# Altium schematic sheet Sheet2.SchDoc
size A4; SheetNumber: 1; SheetTotal: 4
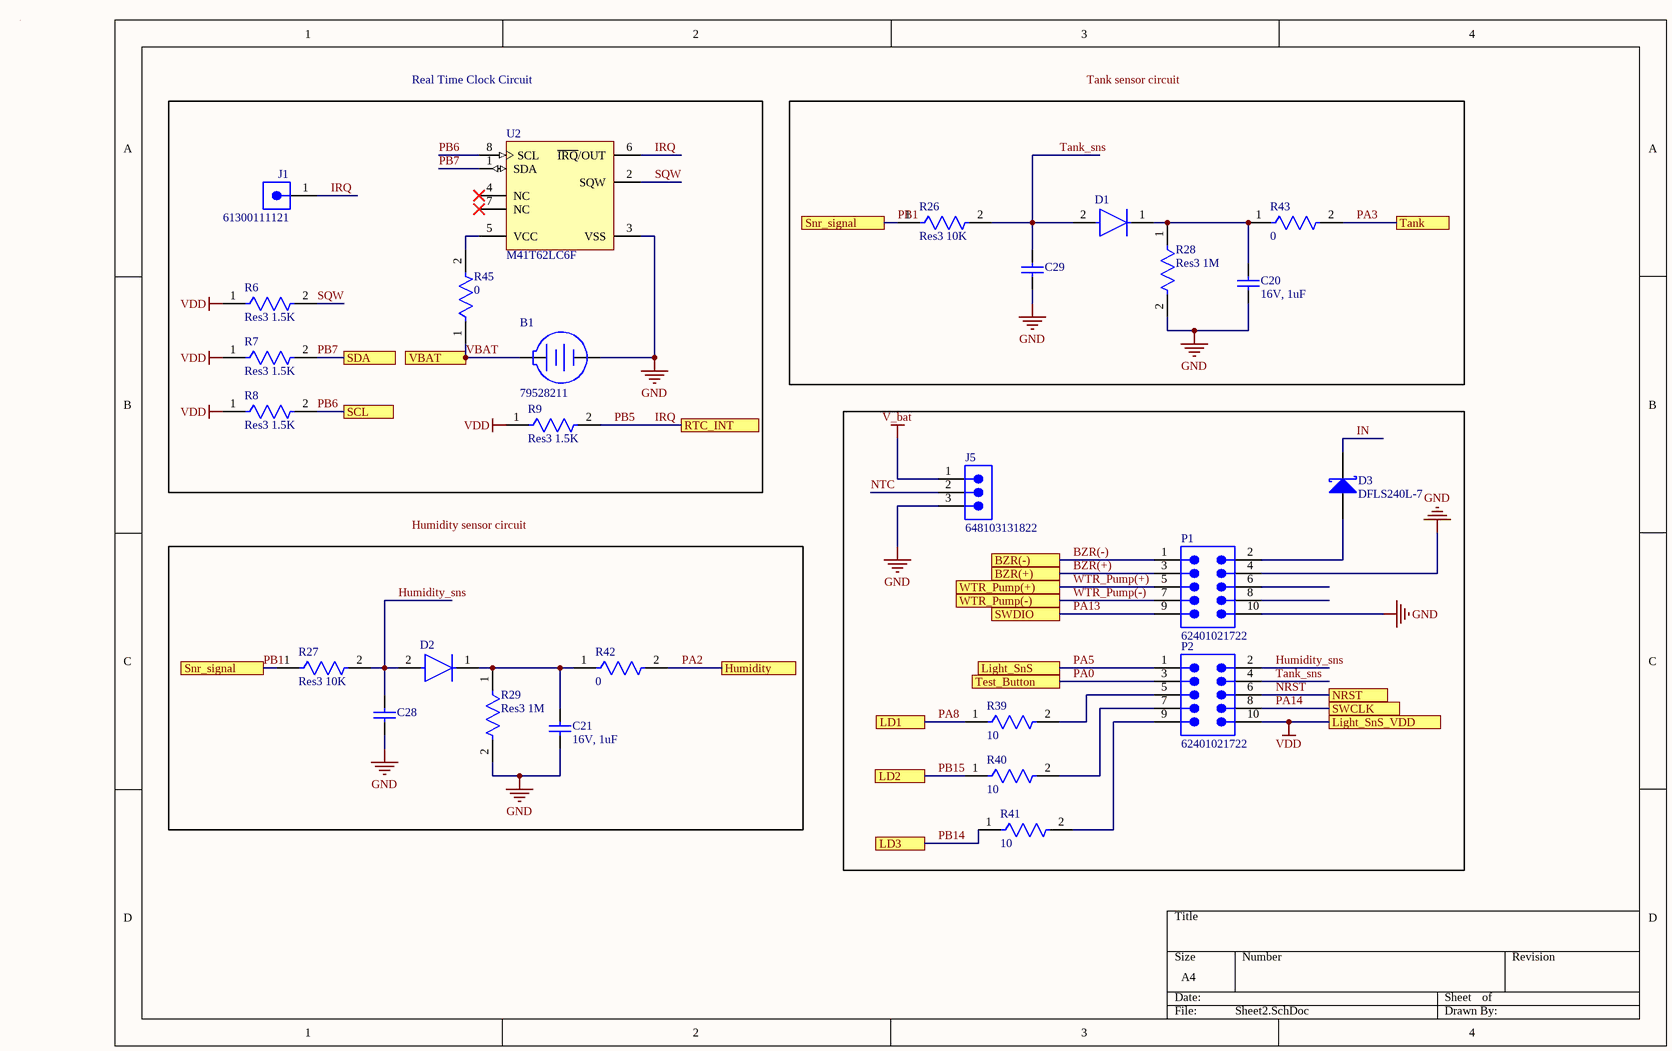
[diagram p0: Sheet2.SchDoc]

## Parts
B1  79528211  [79528211]
C20  16V, 1uF  [CAPC1608X90X35NL15T15]
C21  16V, 1uF  [CAPC1608X90X35NL15T15]
C28  16V, 1uF  [CAPC1608X90X35NL15T15]  (value not drawn)
C29  16V, 1uF  [CAPC1608X90X35NL15T15]  (value not drawn)
D1  1N4148WS-HG3-08  [FP-S8-V-3910_02-001-MFG]  (value not drawn)
D2  1N4148WS-HG3-08  [FP-S8-V-3910_02-001-MFG]  (value not drawn)
D3  DFLS240L-7  [DIOD-POWERDI123-2_A_V]
J1  61300111121  [61300111121]
J5  648103131822  [648103131822]
P1  62401021722  [62401021722]
P2  62401021722  [62401021722]
R6  Res3 1.5K  [FP-AC0603-IPC_B]
R7  Res3 1.5K  [FP-AC0603-MFG]
R8  Res3 1.5K  [FP-AC0603-MFG]
R9  Res3 1.5K  [FP-AC0603-MFG]
R26  Res3 10K  [FP-AC0603-MFG]
R27  Res3 10K  [FP-AC0603-MFG]
R28  Res3 1M  [FP-CRGP0603-IPC_C]
R29  Res3 1M  [FP-CRGP0603-IPC_C]
R39  10  [FP-AC0603-MFG]
R40  10  [FP-AC0603-MFG]
R41  10  [FP-AC0603-MFG]
R42  0  [FP-CRCW0603-MFG]
R43  0  [FP-CRCW0603-MFG]
R45  0  [FP-CRCW0603-MFG]
U2  M41T62LC6F  [STM-LCC8_V]

## Blocks framed on the sheet
Real Time Clock Circuit: B1 J1 R6-R9 R45 U2

## Ports
BZR(+) (see Sheet1[2A]), BZR(-) (see Sheet1[3A]), Humidity (see Sheet3[1C]), LD1 (see Sheet3[3C]), LD2 (see Sheet3[3C]), LD3 (see Sheet3[3C]), Light_SnS (see Sheet3[2D], Sheet3[4B]), Light_SnS_VDD, NRST (see Sheet3[1C]), RTC_INT (see Sheet3[3A]), SCL (see Sheet3[2A]), SDA (see Sheet3[2A]), Snr_signal (see Sheet2[1C], Sheet3[2D]), Snr_signal (see Sheet2[2A], Sheet3[2D]), SWCLK (see Sheet3[3A]), SWDIO (see Sheet3[3B]), Tank (see Sheet3[2D]), Test_Button (see Sheet3[1C]), VBAT (see Sheet3[1B]), WTR_Pump(+) (see Sheet1[3A]), WTR_Pump(-) (see Sheet1[4A])

## Nets
GND: B1.2(-) C20.1 C21.1 C28.1 C29.1 J5.3 P1.4 P1.10 R28.2 R29.2 U2.3(VSS)
V_bat: J5.1
VDD: P2.10 R6.1 R7.1 R8.1 R9.1 ; port Light_SnS_VDD
BZR(+): P1.3 ; port BZR(+)
BZR(-): P1.1 ; port BZR(-)
Humidity_sns: C28.2 D2.2(A) P2.2 R27.2
IN: D3.2(K)
IRQ: J1.1 R9.2 U2.6(~{IRQ}/OUT) ; port RTC_INT  [also labelled PB5]
NRST: P2.6 ; port NRST
NTC: J5.2
PA0: P2.3 ; port Test_Button
PA2: R42.2 ; port Humidity
PA3: R43.2 ; port Tank
PA5: P2.1 ; port Light_SnS
PA8: R39.1 ; port LD1
PA13: P1.9 ; port SWDIO
PA14: P2.8 ; port SWCLK
PB1: R26.1 R27.1 ; port Snr_signal
PB6: R8.2 U2.8(SCL) ; port SCL
PB7: R7.2 U2.1(SDA) ; port SDA
PB14: R41.1 ; port LD3
PB15: R40.1 ; port LD2
SQW: R6.2 U2.2(SQW)
Tank_sns: C29.2 D1.2(A) P2.4 R26.2
VBAT: B1.1(+) R45.1 ; port VBAT
WTR_Pump(+): P1.5 ; port WTR_Pump(+)
WTR_Pump(-): P1.7 ; port WTR_Pump(-)
NetC20_2: C20.2 D1.1(C) R28.1 R43.1
NetC21_2: C21.2 D2.1(C) R29.1 R42.1
NetD3_1: D3.1(A) P1.2
NetP2_5: P2.5 R39.2
NetP2_7: P2.7 R40.2
NetP2_9: P2.9 R41.2
NetR45_2: R45.2 U2.5(VCC)

Not connected (* = marked no-connect by the designer): P1 6 8; U2 4(NC)* 7(NC)*

## Notes on the sheet
- Labels drawn without touching a wire or pin: Humidity sensor circuit, Tank sensor circuit

## Library data of the parts
B1 = CMP-03913-94032818-2: Battery Holder, 2025/2032, Th Rohs Compliant: Yes; Insulation Resistance: 100MΩ; Current Rating: 500mA; Min Operating Temperature: -25°C; Max Operating Temperature: 85°C; RoHS: Compliant
C20 C21 C28 C29 = CMP-1035-02736-2: Manufacturer: AVX Interconnect / Elco; Part Number: 0603YC105JAT2A
D1 D2 = CMP-02540-000082-1: DIODE GEN PURP 100V 150MA SOD323; Reverse Recovery Time: 4ns; Max Reverse Voltage (DC): 100V; RoHS Compliant: Yes; Average Rectified Current: 150mA; Series: Automotive, AEC-Q101; Mount: Surface Mount
D3 = CMP-2000-06158-1: Low VF Schottky Barrier Rectifier, 2 A, 40 V, -55 to 125 degC, 2-Pin SMD, RoHS, Tape and Reel; Manufacturer: Diodes Inc; Reverse Voltage-Max [Vrrm]: 40V; Forward Voltage: 0.5V; Average Rectified Current-Max: 2A; Peak Current-Max: 50A; Reverse Current-Max: 100µA; Mounting Technology: SurfaceMount; Package Description: 2-Pin Small Outline Diode, Body 2.8 x 1.78 mm; Manufacturer URL: http://www.diodes.com/; Datasheet URL: http://www.diodes.com/_files/datasheets/ds30516.pdf; Package Reference: POWERDI123-2_A; Datasheet Version: Rev. 8-2, 11/2009
J1 = CMP-1502-01058-4: THT Vertical Pin Header WR-PHD, Pitch 2.54 mm, Single Row, 1 pins; Gender: Male; Contact Resistance: 20mΩ; Current Rating: 3A; Number of Contacts: 1; Connector Type: Male Pin; Operating Supply Voltage: 250V; Termination: Solder; Mount: Through Hole; Orientation: Vertical; Contact Material: Copper; Number of Positions: 1; Color: Black; Packaging: Bulk; Contact Plating: Gold; Number of Pins: 1; Contact Mating Length: 5.9944mm; RoHS: Compliant; Number of Rows: 1; Lead Pitch: 2.54mm
J5 = CMP-1502-00731-3: Wr-wtb; 1.5MM Pitch 3 Way 1 Row Shrouded Straight Pcb Header, Through Hole; Insulation Resistance: 500MΩ; Connector Type: Male Pin; Number of Contacts: 3; Voltage Rating: 50V; Gender: Male; Current Rating: 1A; Insulation: Insulated; Contact Resistance: 20mΩ; Number of Pins: 3; Lead Pitch: 1.5mm; Width: 7.5mm; Max Operating Temperature: 85°C; Packaging: Tape and Reel; Termination: SMD/SMT; Contact Material: Copper; Contact Gender: Male; Min Operating Temperature: -25°C; RoHS: Compliant; Operating Supply Voltage: 50V; Number of Positions: 3; Length: 7.5mm; Pitch: 1.5mm; Color: Beige, White; Housing Material: Nylon; Height: 3.7mm; Flammability Rating: UL94 V-0; Contact Plating: Tin; Number of Rows: 1; Mount: Surface Mount
P1 P2 = CMP-1502-00696-3: WR-WTB Wire-to-Board Connectors 2.00 mm; Number of Positions: 10; Pitch: 2mm; Contact Resistance: 20mΩ; Connector Type: Male Pin, Terminal Block; Row Spacing: 5.0038mm; Operating Supply Voltage: 250V; Insulation Resistance: 1GΩ; Gender: Male; Current Rating: 3A; Color: White; Contact Material: Copper; Insulation Material: PBT; Height: 11.7mm; Mount: Through Hole; Number of Contacts: 10; RoHS: Compliant; Number of Pins: 10; Length: 13.4mm; Fastening Type: Latch; Contact Gender: Male; Max Operating Temperature: 85°C; Number of Rows: 2; Min Operating Temperature: -25°C; Housing Material: Polyester; Contact Plating: Tin; REACH SVHC: Unknown; Termination: Solder; Lead Pitch: 2mm; Width: 13.4mm
R6-R9 = CMP-03412-039623-1: RES 1.5kΩ 1.00% 0.2W 0603
R26 R27 = CMP-03412-038553-1: RES 10kΩ 1.00% 0.2W 0603
R28 R29 = CMP-03211-004384-3: RES 1M OHM 1% 1/4W 0603; Resistance: 1MR; Max Power Dissipation: 250mW; Temperature Coefficient: 100ppm/°C; Case Code (Imperial): 0603; Min Operating Temperature: -55°C; Max Operating Temperature: 155°C; RoHS Compliant: Yes; Packaging: Cut Tape; Case/Package: 0603; Tolerance: 1%; Resistor Type: Thick Film; Case Code (Metric): 1608; Number of Terminations: 2
R39-R41 = CMP-03412-042500-1: RES 10kΩ 5.00% 0.1W 0603; Tolerance: 5%; Resistance: 10kR; Case/Package: 0603; Lead Free: Lead Free; RoHS Compliant: Yes
R42 R43 R45 = CMP-02407-011577-1: RES SMD 0 OHM JUMPER 1/10W 0603; Resistance: 0R; Tolerance: 5%; Power Dissipation: 100mW; Voltage Rating (DC): 75V; Temperature Coefficient: 100ppm/°C; Min Operating Temperature: -55°C; RoHS Compliant: No; Military Standard: Not; Case Code (Imperial): 0603; Series: CRCW; Resistor Type: Thick Film; Features: Automotive AEC-Q200; Power Rating: 100mW; Radiation Hardening: No; Case/Package: 0603; Width: 0.033inch; Length: 1.55mm; Case Code (Metric): 1608; Depth: 0.85mm; Package Quantity: 5000; Size Code: 0603; Weight: 7.1E-05oz; Termination: SMD/SMT; Lead Free: Contains Lead; Packaging: Tape and Reel; Contact Plating: Tin; Max Operating Temperature: 155°C; Number of Terminations: 2; Max Power Dissipation: 100mW; Construction: Rectangular; Mount: Surface Mount; Height: 0.02inch; Voltage Rating: 75V
U2 = CMP-2000-06643-1: Low-Power Serial Real-Time Clock (RTC) with Alarm, 400 KHz, 1.3 to 4.4 V, -40 to 85 degC, 8-Pin LCC, RoHS, Tape and Reel; Manufacturer: STMicroelectronics; Interface: I²C,2-WireSerial; Current - Timekeeping (Max): 0.7µA~0.95µA@1.3V~4.4V; Other Related Documents: M41T62ViewAllSpecifications; Date Format: YY-MM-DD-dd; Voltage - Supply: 1.3V~4.4V; Online Catalog: SerialAddress; For Use With: 497-16464-ND / -EVALBOARDFORM41T62; Time Format: HH:MM:SS:hh(24hr); Other Names: 497-11275-1; Product Training Modules: SmartGridSolutions:SmartGridDistribution/SmartMeters; Standard Package: 1; Mounting Technology: SurfaceMount; Operating Temperature: -40°C~85°C; Features: Alarm,LeapYear,SquareWaveOutput,WatchdogTimer; Packaging: CutTape(CT); Family: Clock/Timing-RealTimeClocks; Package Description: 8-Pin Leadless Ceramic Chip Carrier, Body 3.2 x 1.5 mm, Pitch 0.9 mm; Mounting Type: SurfaceMount; Series: Timekeeper®; Manufacturer URL: http://www.st.com/; Datasheet URL: http://www.st.com/web/en/resource/technical/document/datasheet/CD00019860.pdf; Package Reference: LCC8; Package / Case: 8-LCC; Type: Clock/Calendar; Category: IntegratedCircuits(ICs); Datasheet Version: Rev. 22, 10/2015; Supplier Device Package: 8-LCC(1.5x3.2)